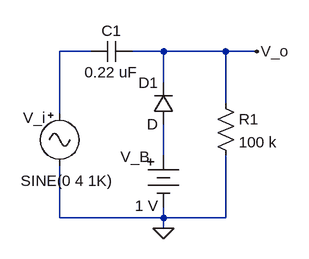
[diagram p0: schematic fig3.asc]
fig3.asc, the LTspice schematic file:
Version 4
SHEET 1 880 680
WIRE 80 32 32 32
WIRE 192 32 144 32
WIRE 288 32 192 32
WIRE 336 32 288 32
WIRE 192 80 192 32
WIRE 288 112 288 32
WIRE 32 128 32 32
WIRE 192 192 192 144
WIRE 32 288 32 208
WIRE 192 288 192 272
WIRE 192 288 32 288
WIRE 288 288 288 192
WIRE 288 288 192 288
WIRE 192 304 192 288
FLAG 192 304 0
FLAG 336 32 V_o
SYMBOL cap 144 16 R90
WINDOW 0 0 32 VBottom 2
WINDOW 3 32 32 VTop 2
SYMATTR InstName C1
SYMATTR Value 0.22 uF
SYMBOL diode 208 144 R180
WINDOW 0 24 64 Left 2
WINDOW 3 24 0 Left 2
SYMATTR InstName D1
SYMBOL res 272 96 R0
SYMATTR InstName R1
SYMATTR Value 100 k
SYMBOL Misc\\battery 192 176 R0
WINDOW 0 -66 18 Left 2
WINDOW 3 -44 93 Left 2
SYMATTR InstName V_B
SYMATTR Value 1 V
SYMBOL Misc\\signal 32 112 R0
WINDOW 0 -56 22 Left 2
WINDOW 3 -60 119 Left 2
SYMATTR InstName V_i
SYMATTR Value SINE(0 4 1K)

The netlist it stands for:
* fig3.asc
C1 V_o N001 0.22 uF
D1 N002 V_o D
R1 V_o 0 100 k
V_B N002 0 1 V
V_i N001 0 SINE(0 4 1K)
.model D D
.lib standard.dio
.backanno
.end